# Altium schematic sheet CanControllers.SchDoc
size A4; SheetNumber: 3; SheetTotal: 3
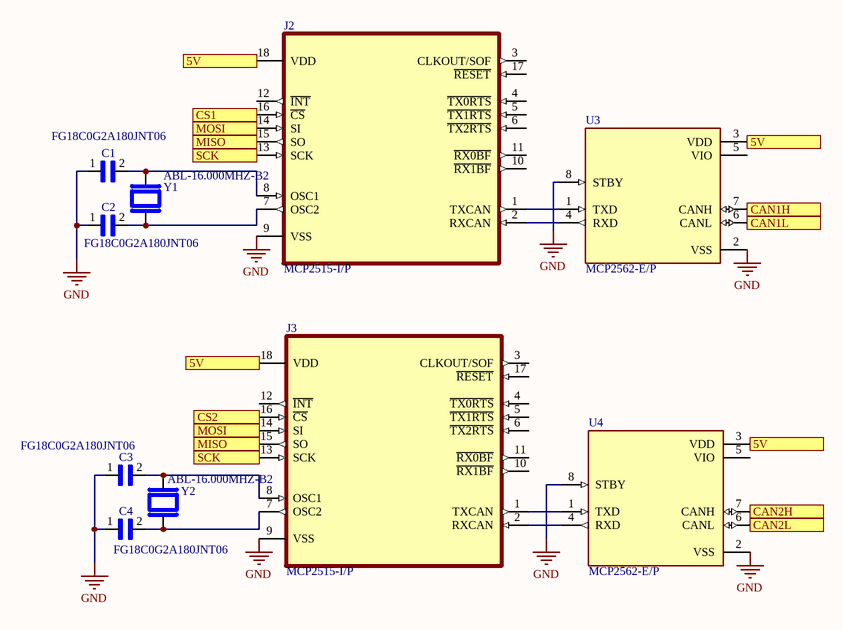
[diagram p0: CanControllers.SchDoc]

## Parts
C1  FG18C0G2A180JNT06  [CAPRB250W50L400T250H550]
C2  FG18C0G2A180JNT06  [CAPRB250W50L400T250H550]
C3  FG18C0G2A180JNT06  [CAPRB250W50L400T250H550]
C4  FG18C0G2A180JNT06  [CAPRB250W50L400T250H550]
J2  MCP2515-I/P  [DIP254P762X432-18]
J3  MCP2515-I/P  [DIP254P762X432-18]
U3  MCP2562-E/P  [DIP787W45P254L1016H533Q8]
U4  MCP2562-E/P  [DIP787W45P254L1016H533Q8]
Y1  ABL-16.000MHZ-B2  [XTAL_HC49P488W46L1150T500H350]
Y2  ABL-16.000MHZ-B2  [XTAL_HC49P488W46L1150T500H350]

## Ports
5V, CAN1H, CAN1L, CAN2H, CAN2L, CS1, CS2, MISO, MOSI, SCK

## Nets
GND: C1.1 C2.1 C3.1 C4.1 J2.9(VSS) J3.9(VSS) U3.2(VSS) U3.8(STBY) U4.2(VSS) U4.8(STBY)
5V: J2.18(VDD) J3.18(VDD) U3.3(VDD) U4.3(VDD) ; port 5V
CAN1H: U3.7(CANH) ; port CAN1H
CAN1L: U3.6(CANL) ; port CAN1L
CAN2H: U4.7(CANH) ; port CAN2H
CAN2L: U4.6(CANL) ; port CAN2L
CS1: J2.16(~{CS}) ; port CS1
CS2: J3.16(~{CS}) ; port CS2
MISO: J2.15(SO) J3.15(SO) ; port MISO
MOSI: J2.14(SI) J3.14(SI) ; port MOSI
SCK: J2.13(SCK) J3.13(SCK) ; port SCK
NetC1_2: C1.2 J2.8(OSC1) Y1.2
NetC2_2: C2.2 J2.7(OSC2) Y1.1
NetC3_2: C3.2 J3.8(OSC1) Y2.2
NetC4_2: C4.2 J3.7(OSC2) Y2.1
NetJ2_1: J2.1(TXCAN) U3.1(TXD)
NetJ2_2: J2.2(RXCAN) U3.4(RXD)
NetJ3_1: J3.1(TXCAN) U4.1(TXD)
NetJ3_2: J3.2(RXCAN) U4.4(RXD)

Not connected (* = marked no-connect by the designer): J2 3(CLKOUT/SOF) 4(~{TX0RTS}) 5(~{TX1RTS}) 6(~{TX2RTS}) 10(~{RX1BF}) 11(~{RX0BF}) 12(~{INT}) 17(~{RESET}); J3 3(CLKOUT/SOF) 4(~{TX0RTS}) 5(~{TX1RTS}) 6(~{TX2RTS}) 10(~{RX1BF}) 11(~{RX0BF}) 12(~{INT}) 17(~{RESET}); U3 5(VIO); U4 5(VIO)

## Library data of the parts
C1-C4 = FG18C0G2A180JNT06: Cap Ceramic 18pF 100V C0G 5% Radial 2.5mm 125Â°C Ammo; MF: TDK; Package: Radial TDK Corporation; Purchase-URL: https://pricing.snapeda.com/search/part/FG18C0G2A180JNT06/?ref=eda; Value: *; Availability: In Stock; SnapEDA_Link: https://www.snapeda.com/parts/FG18C0G2A180JNT06/TDK/view-part/?ref=snap; MP: FG18C0G2A180JNT06; Price: None; Check_prices: https://www.snapeda.com/parts/FG18C0G2A180JNT06/TDK/view-part/?ref=eda
J2 J3 = MCP2515-I/P: CAN 1Mbps Sleep/Standby 3.3V/5V 18-Pin PDIP Tube; MF: Microchip Technology; Purchase-URL: https://pricing.snapeda.com/search/part/MCP2515-I/P/?ref=eda; Package: PDIP-18 Micrel; MP: MCP2515-I/P; Value: *; SnapEDA_Link: https://www.snapeda.com/parts/MCP2515-I/P/Microchip/view-part/?ref=snap; Availability: In Stock; Price: None; Check_prices: https://www.snapeda.com/parts/MCP2515-I/P/Microchip/view-part/?ref=eda
U3 U4 = CMP-003-000000-1: 1/1 Transceiver Half CANbus 8-PDIP; MF: Microchip; Value: *; Package: DIP-8 Microchip; Component Type: Standard; Design Item ID: MCP2562-E/P; Source: SnapEDAsch.SchLib; Pin Count: 8; SnapEDA_Link: https://www.snapeda.com/parts/MCP2562-E/P/Microchip/view-part/290285/?ref=snap; MP: MCP2562-E/P; Digi-Key_Part_Number: MCP2562-E/P-ND; DigiKey-Purchase-URL: https://snapeda.com/shop?store=DigiKey&id=290285
Y1 Y2 = ABL-16.000MHZ-B2: HC/49US (AT49) MICROPROCESSOR CRYSTAL; MF: Abracon; Availability: In Stock; SnapEDA_Link: https://www.snapeda.com/parts/ABL-16.000MHZ-B2/Abracon+LLC/view-part/?ref=snap; MP: ABL-16.000MHZ-B2; Price: None; Value: *; Check_prices: https://www.snapeda.com/parts/ABL-16.000MHZ-B2/Abracon+LLC/view-part/?ref=eda; Purchase-URL: https://pricing.snapeda.com/search/part/ABL-16.000MHZ-B2/?ref=eda; Package: HC-49/US ABRACON